# Altium schematic sheet USB_CY7C68001-56LFC.SchDoc: High-Speed USB 2.0 Controller
size A4; Organization: Altium Limited.; Address1: Level 3, 12a Rodborough Rd; Address2: Frenchs Forest 2086; Address3: NSW; Address4: AUSTRALIA; Revision: 6; SheetNumber: 24; SheetTotal: 64
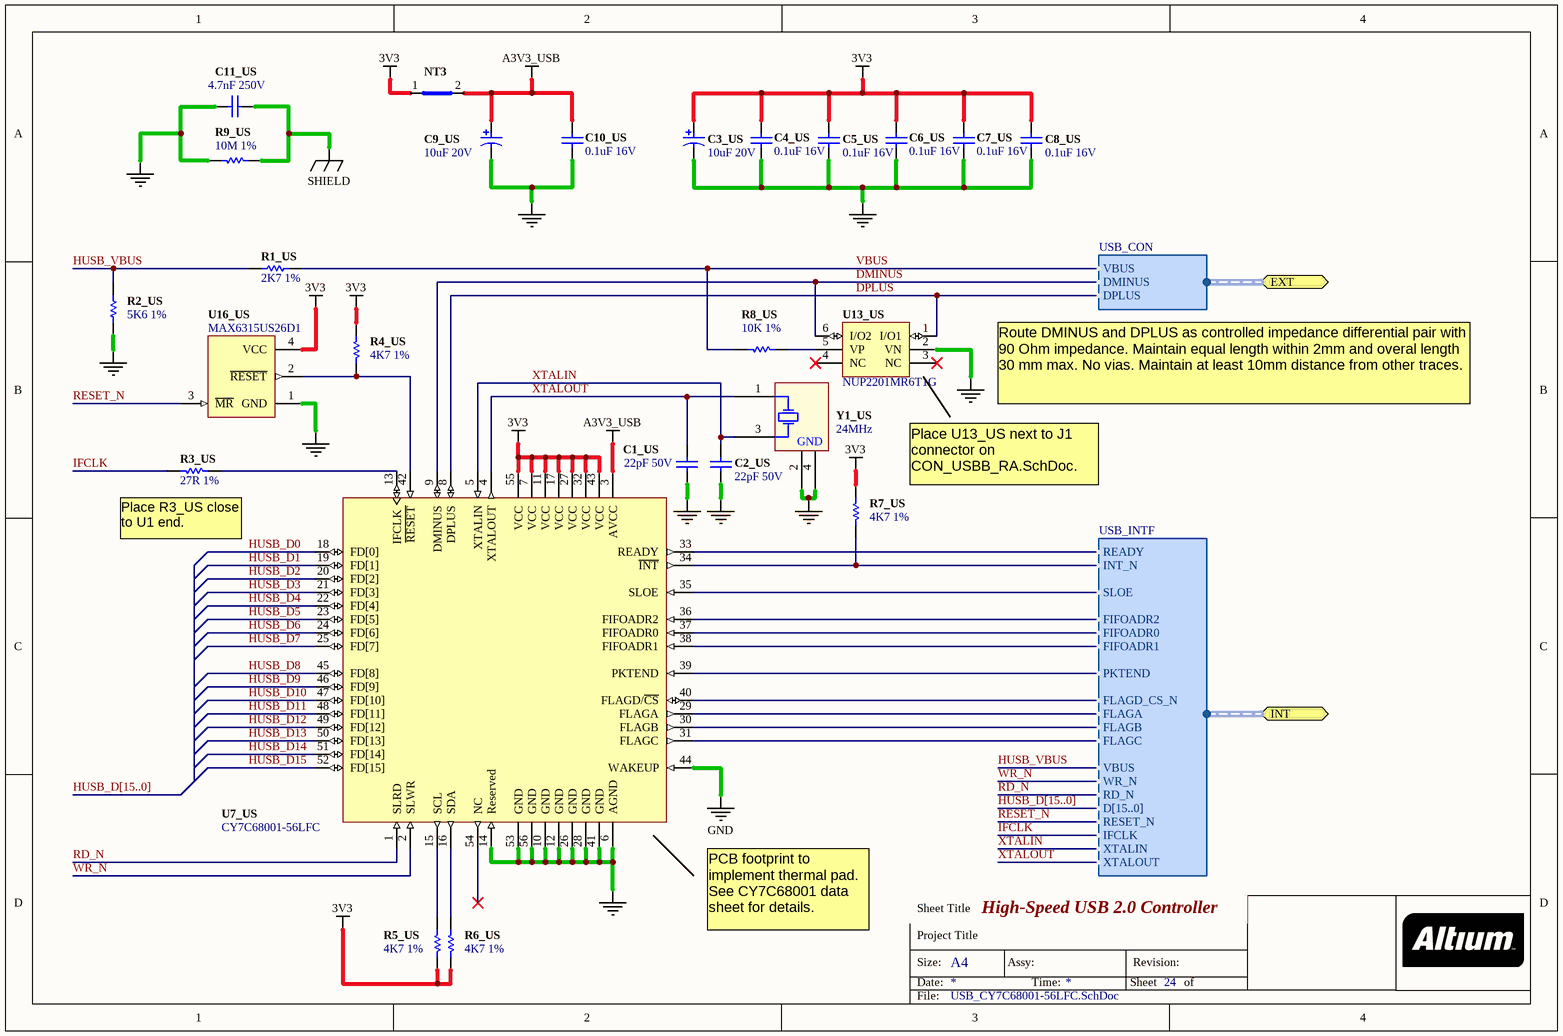
[diagram p0: USB_CY7C68001-56LFC.SchDoc]

## Parts
C1_US  22pF 50V  [CAPC1005-STAR]
C2_US  22pF 50V  [CAPC1005-STAR]
C3_US  10uF 20V  [CAPC3528-STAR]
C4_US  0.1uF 16V  [CAPC1005-STAR]
C5_US  0.1uF 16V  [CAPC1005-STAR]
C6_US  0.1uF 16V  [CAPC1005-STAR]
C7_US  0.1uF 16V  [CAPC1005-STAR]
C8_US  0.1uF 16V  [CAPC1005-STAR]
C9_US  10uF 20V  [CAPC3528-STAR]
C10_US  0.1uF 16V  [CAPC1005-STAR]
C11_US  4.7nF 250V  [CAPM7163]
NT3  Net Tie SMT2  [NETTIE-SMT2-31X51]  (value not drawn)  (net tie, no BOM)
R1_US  2K7 1%  [RESC1005-STAR]
R2_US  5K6 1%  [RESC1005-STAR]
R3_US  27R 1%  [RESC1005-STAR]
R4_US  4K7 1%  [RESC1005-STAR]
R5_US  4K7 1%  [RESC1005-STAR]
R6_US  4K7 1%  [RESC1005-STAR]
R7_US  4K7 1%  [RESC1005-STAR]
R8_US  10K 1%  [RESC1005-STAR]
R9_US  10M 1%  [RESC3216]
U7_US  CY7C68001-56LFC  [QFN50P800X800_HS-57]
U13_US  NUP2201MR6T1G  [TSOP95P275-6]
U16_US  MAX6315US26D1  [SOT143]
Y1_US  24MHz  [XTAL-200X126-4]

## Ports
EXT (harness USB_CON), INT (harness USB_INTF)

## Harnesses
USB_INTF: READY, INT_N, SLOE, FIFOADR2, FIFOADR0, FIFOADR1, PKTEND, FLAGD_CS_N, FLAGA, FLAGB, FLAGC, WR_N, RD_N, D[15..0], RESET_N, IFCLK, XTALIN, VBUS, XTALOUT
USB_CON: VBUS, DMINUS, DPLUS

## Nets
3V3: C3_US.1 C4_US.2 C5_US.1 C6_US.2 C7_US.2 C8_US.1 NT3.1(Net1) R4_US.2 R5_US.1 R6_US.1 R7_US.2 U7_US.7(VCC) U7_US.11(VCC) U7_US.17(VCC) U7_US.27(VCC) U7_US.32(VCC) U7_US.43(VCC) U7_US.55(VCC) U16_US.4(VCC)
A3V3_USB: C9_US.1 C10_US.2 NT3.2(Net2) U7_US.3(AVCC)
GND: C1_US.2 C2_US.2 C3_US.2 C4_US.1 C5_US.2 C6_US.1 C7_US.1 C8_US.2 C9_US.2 C10_US.1 C11_US.2 R2_US.2 R9_US.2 U7_US.6(AGND) U7_US.10(GND) U7_US.12(GND) U7_US.14(Reserved) U7_US.26(GND) U7_US.28(GND) U7_US.41(GND) U7_US.44(WAKEUP) U7_US.53(GND) U7_US.56(GND) U13_US.2(VN) U16_US.1(GND) Y1_US.2(GND) Y1_US.4(GND)
SHIELD: C11_US.1 R9_US.1
DMINUS: U7_US.9(DMINUS) U13_US.6(I/O2) ; port EXT.DMINUS
DPLUS: U7_US.8(DPLUS) U13_US.1(I/O1) ; port EXT.DPLUS
HUSB_D0: U7_US.18(FD[0])
HUSB_D1: U7_US.19(FD[1])
HUSB_D2: U7_US.20(FD[2])
HUSB_D3: U7_US.21(FD[3])
HUSB_D4: U7_US.22(FD[4])
HUSB_D5: U7_US.23(FD[5])
HUSB_D6: U7_US.24(FD[6])
HUSB_D7: U7_US.25(FD[7])
HUSB_D8: U7_US.45(FD[8])
HUSB_D9: U7_US.46(FD[9])
HUSB_D10: U7_US.47(FD[10])
HUSB_D11: U7_US.48(FD[11])
HUSB_D12: U7_US.49(FD[12])
HUSB_D13: U7_US.50(FD[13])
HUSB_D14: U7_US.51(FD[14])
HUSB_D15: U7_US.52(FD[15])
HUSB_VBUS: R1_US.1 R2_US.1 ; port INT.VBUS
IFCLK: R3_US.1 ; port INT.IFCLK
RD_N: U7_US.1(SLRD) ; port INT.RD_N
RESET_N: U16_US.3(~{MR}) ; port INT.RESET_N
VBUS: R1_US.2 R8_US.1 ; port EXT.VBUS
WR_N: U7_US.2(SLWR) ; port INT.WR_N
XTALIN: C2_US.1 U7_US.5(XTALIN) Y1_US.3(X2) ; port INT.XTALIN
XTALOUT: C1_US.1 U7_US.4(XTALOUT) Y1_US.1(X1) ; port INT.XTALOUT
NetR3_US_2: R3_US.2 U7_US.13(IFCLK)
NetR4_US_1: R4_US.1 U7_US.42(~{RESET}) U16_US.2(~{RESET})
NetR5_US_2: R5_US.2 U7_US.15(SCL)
NetR6_US_2: R6_US.2 U7_US.16(SDA)
NetR7_US_1: R7_US.1 U7_US.34(~{INT}) ; port INT.INT_N
NetR8_US_2: R8_US.2 U13_US.5(VP)
NetU7_US_29: U7_US.29(FLAGA) ; port INT.FLAGA
NetU7_US_30: U7_US.30(FLAGB) ; port INT.FLAGB
NetU7_US_31: U7_US.31(FLAGC) ; port INT.FLAGC
NetU7_US_33: U7_US.33(READY) ; port INT.READY
NetU7_US_35: U7_US.35(SLOE) ; port INT.SLOE
NetU7_US_36: U7_US.36(FIFOADR2) ; port INT.FIFOADR2
NetU7_US_37: U7_US.37(FIFOADR0) ; port INT.FIFOADR0
NetU7_US_38: U7_US.38(FIFOADR1) ; port INT.FIFOADR1
NetU7_US_39: U7_US.39(PKTEND) ; port INT.PKTEND
NetU7_US_40: U7_US.40(FLAGD/~{CS}) ; port INT.FLAGD_CS_N

Not connected (* = marked no-connect by the designer): U7_US 54(NC)*; U13_US 3(NC)* 4(NC)*

## Buses and harness runs
bus HUSB_D[15..0]

## Notes on the sheet
- Route DMINUS and DPLUS as controlled impedance differential pair with 90 Ohm impedance. Maintain equal length within 2mm and overal length 30 mm max. No vias. Maintain at least 10mm distance from other traces.
- Place U13_US next to J1 connector on CON_USBB_RA.SchDoc.
- (near R3_US) Place R3_US close to U1 end.
- (near U7_US) PCB footprint to implement thermal pad. See CY7C68001 data sheet for details.
- Sheet Title
- Project Title
- Size:
- Date:
- A4
- Assy:
- Time:
- Sheet
- Revision:
- of
- File:

## Library data of the parts
C1_US C2_US = D-101-0059: Capacitor, Ceramic, 22pF 5% 50V 0402 (1005) COG; Polarity: Non-Polarized; Category: Capacitor; Capacitance: 22 pF; Dielectric: COG; Mounting Technology: Surface Mount; Rated Voltage: 50 V; Status: Unreleased; Technology: Ceramic; Tolerance: 5 %
C3_US C9_US = D-101-0007: Capacitor, Tantalum, 10uF 10% 20V MCCT-B (3528); Polarity: Polarized; Category: Capacitor; Capacitance: 10 uF; Mounting Technology: Surface Mount; Rated Voltage: 20 V; Status: Production; Technology: Tantalum; Tolerance: 10 %
C4_US C5_US C6_US C7_US C8_US C10_US = D-101-0080: Capacitor, Ceramic, 0.1uF 10% 16V 0402 (1005) X7R; Polarity: Non-Polarized; Category: Capacitor; Capacitance: 0.1 uF; Dielectric: X7R; Mounting Technology: Surface Mount; Rated Voltage: 16 V; Status: Production; Technology: Ceramic; Tolerance: 10 %
C11_US = D-101-0019: Capacitor, Ceramic, 4.7nF 20% 250V Panasonic BC J Lead (CAPM7163) Y5V; Polarity: Non-Polarized; Tolerance: 20% %; Category: Capacitor; Capacitance: 4.7 nF; Dielectric: Y5V; Mounting Technology: Surface Mount; Rated Voltage: 250 V; Status: Production; Technology: Ceramic
NT3 = D-002-0003: Net-Tie, Surface Mount, 2 x 1.6mm x 0.8mm SMT Pads - For 0.8mm Track; Category: Net-Tie; Status: Production
R1_US = D-100-0105: Resistor, 2K7 1% 0402 (1005); Power Rating: 63 mW; Resistance: 2.7 K; Category: Resistor; Mounting Technology: Surface Mount; Status: Production; Tolerance: 1 %
R2_US = D-100-0086: Resistor, 5K6 1% 0402 (1005); Power Rating: 63 mW; Resistance: 5.6 K; Category: Resistor; Mounting Technology: Surface Mount; Status: Production; Tolerance: 1 %
R3_US = D-100-0108: Resistor, 27R 1% 0402 (1005); Power Rating: 63 mW; Category: Resistor; Mounting Technology: Surface Mount; Resistance: 27 R; Status: Production; Tolerance: 1 %
R4_US R5_US R6_US R7_US = D-100-0088: Resistor, 4K7 1% 0402 (1005); Power Rating: 63 mW; Resistance: 4.7 K; Category: Resistor; Mounting Technology: Surface Mount; Status: Production; Tolerance: 1 %
R8_US = D-100-0130: Resistor, 10K 1% 0402 (1005); Power Rating: 63 mW; Category: Resistor; Mounting Technology: Surface Mount; Resistance: 10 K; Status: Production; Tolerance: 1 %
R9_US = D-100-0059: Resistor, 10M 1%1206 (3216); Power Rating: 250 mW; Category: Resistor; Mounting Technology: Surface Mount; Resistance: 10 M; Status: Deprecated; Tolerance: 1 %
U7_US = D-221-0004: CY7C68001-56LFC, EZ-USB SX2 High-Speed USB Interface; Comm Standard: None; Category: IC-Communication; Mounting Technology: Surface Mount; Status: Production
U13_US = D-204-0001: NUP2201MR6, Low Capacitance Diode Array, USB Protection; Max Input Voltage: mV; Max Output Current: mA; Category: IC-Power; Max Output Voltage: mV; Min Input Voltage: mV; Min Output Voltage: mV; Mounting Technology: Surface Mount; Status: Production; Supply Voltage: mV
U16_US = D-243-0000: MAX6315, Open-Drain Output SOT Reset IC, Customized Reset Thresholds, Timeout Delays; Category: IC-Other; Status: Production
Y1_US = D-103-0013: Crystal, SMD, 24.000000MHz Stab=30ppm 20.0pF; Frequency Stability: 30 ppm; Load Capacitance: 20 pF; Nominal Operational Voltage: mV; Category: Crystal; Frequency Tolerance: 30 ppm; Mounting Technology: Surface Mount; Nominal Fequency: 24 MHz; Status: Unreleased